# EAGLE design Drum Machine Side Lights (EAGLE 5.07)
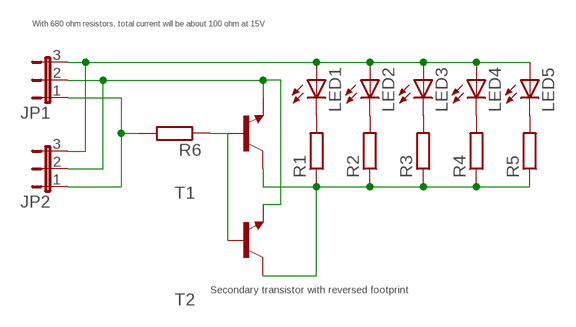
[diagram p0: schematic, sheet 1]

## Parts
JP1  JP2E  [JP2]
JP2  JP2E  [JP2]
LED1  LED3MM  [LED3MM]
LED2  LED3MM  [LED3MM]
LED3  LED3MM  [LED3MM]
LED4  LED3MM  [LED3MM]
LED5  LED3MM  [LED3MM]
R1  R-EU_0207/7  [0207/7]
R2  R-EU_0207/7  [0207/7]
R3  R-EU_0207/7  [0207/7]
R4  R-EU_0207/7  [0207/7]
R5  R-EU_0207/7  [0207/7]
R6  R-EU_0207/7  [0207/7]
T1  2N4124-NPN-TO92-CBE  [TO92-CBE]
T2  BC547A-NPN-TO92-EBC  [TO92-EBC]

## Nets
GROUND: JP1.2 JP2.2 T1.E T2.E
N$1: LED1.K(C) R1.2
N$2: LED2.K(C) R2.2
N$3: LED3.K(C) R3.2
N$4: LED4.K(C) R4.2
N$5: LED5.K(C) R5.2
N$8: R1.1 R2.1 R3.1 R4.1 R5.1 T1.C T2.C
N$13: R6.1 T1.B T2.B
POWER: JP1.3 JP2.3 LED1.A LED2.A LED3.A LED4.A LED5.A
TOGGLE: JP1.1 JP2.1 R6.2

## Notes on the sheet
- With 680 ohm resistors, total current will be about 100 ohm at 15V
- Secondary transistor with reversed footprint

## Library data of the parts
JP1 JP2 = jumper:JP2E: JUMPER
LED1-LED5 = led:LED: LED OSRAM: - CHIPLED LG R971, LG N971, LY N971, LG Q971, LY Q971, LO R971, LY R971 LH N974, LH R974 LS Q976, LO Q976, LY Q976 LO Q996 - Hyper CHIPLED LW Q18S LB Q993, LB Q99A, LB R99A - SideLED LS A670, LO A670, LY A670, LG A670, LP A670 LB A673, LV A673, LT A673, LW A673 LH A674 LY A675 LS A676, LA A676, LO A676, LY A676, LW A676 LS A679, LY A679, LG A679 - Hyper Micro SIDELED® LS Y876, LA Y876, LO Y876, LY Y876 LT Y87S - SmartLED LW L88C, LW L88S LB L89C, LB L89S, LG L890 LS L89K, LO L89K, LY L89K LS L896, LA L896, LO L896, LY L896 - TOPLED LS T670, LO T670, LY T670, LG T670, LP T670 LSG T670, LSP T670, LSY T670, LOP T670, LYG T670 LG T671, LOG T671, LSG T671 LB T673, LV T673, LT T673, LW T673 LH T674 LS T676, LA T676, LO T676, LY T676, LB T676, LH T676, LSB T676, LW T676 LB T67C, LV T67C, LT T67C, LS T67K, LO T67K, LY T67K, LW E67C LS E67B, LA E67B, LO E67B, LY E67B, LB E67C, LV E67C, LT E67C LW T67C LS T679, LY T679, LG T679 LS T770, LO T770, LY T770, LG T770, LP T770 LB T773, LV T773, LT T773, LW T773 LH T774 LS E675, LA E675, LY E675, LS T675 LS T776, LA T776, LO T776, LY T776, LB T776 LHGB T686 LT T68C, LB T68C - Hyper Mini TOPLED® LB M676 - Mini TOPLED Santana® LG M470 LS M47K, LO M47K, LY M47K Source: http://www.osram.convergy.de LUXEON: - LUMILED® LXK2-PW12-R00, LXK2-PW12-S00, LXK2-PW14-U00, LXK2-PW14-V00 LXK2-PM12-R00, LXK2-PM12-S00, LXK2-PM14-U00 LXK2-PE12-Q00, LXK2-PE12-R00, LXK2-PE12-S00, LXK2-PE14-T00, LXK2-PE14-U00 LXK2-PB12-K00, LXK2-PB12-L00, LXK2-PB12-M00, LXK2-PB14-N00, LXK2-PB14-P00, LXK2-PB14-Q00 LXK2-PR12-L00, LXK2-PR12-M00, LXK2-PR14-Q00, LXK2-PR14-R00 LXK2-PD12-Q00, LXK2-PD12-R00, LXK2-PD12-S00 LXK2-PH12-R00, LXK2-PH12-S00 LXK2-PL12-P00, LXK2-PL12-Q00, LXK2-PL12-R00 Source: www.luxeon.com KINGBRIGHT: KA-3528ASYC Source: www.kingbright.com
R1-R6 = resistor:R-EU_: RESISTOR, European symbol
T1 T2 = transistor:*-NPN-: NPN Transistror BF959 corrected 2008.03.06

## Board
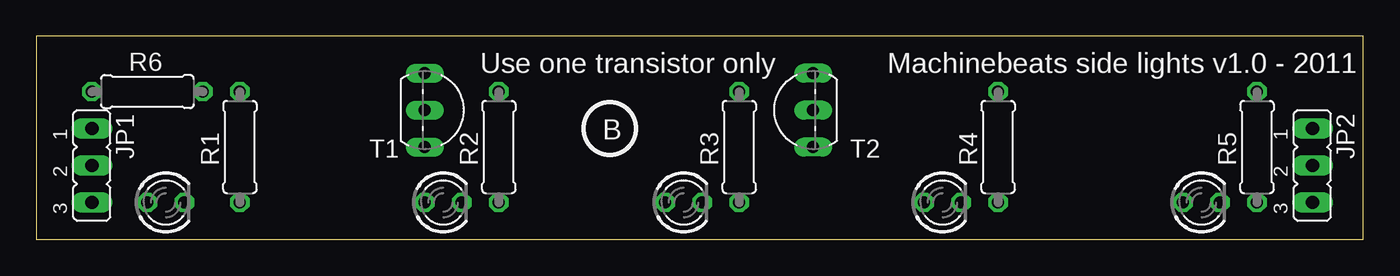
[diagram p1: board, top side]
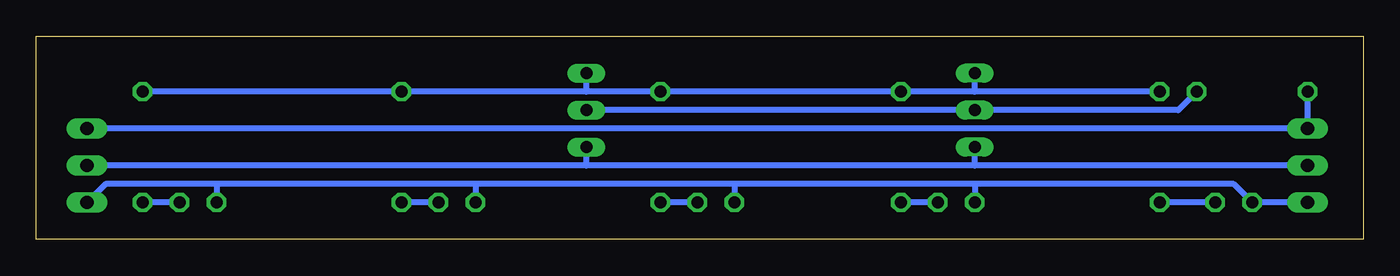
[diagram p2: board, bottom side, seen from below]

Size 91.11 x 13.96 mm. Coordinates in mm from the lower left corner, seen from the top.
Outline: 0,0 91.11,0 91.11,13.96 0,13.96 0,0
Copper layers (1*16): Top 0.035mm / dielectric 1.5mm / Bottom 0.035mm
Design rules "default": minimum track width 10mil, minimum drill 24mil, track to track 8mil, track to pad 8mil, pad to pad 8mil, via to via 8mil, smd to smd 8mil, copper to edge 40mil, drill to drill 8mil, minimum pad ring 10mil, minimum via ring 8mil, stop-mask expansion 4mil, vias tented up to drill 0mil, thermal gap 10mil

### Footprints (pad centres in the part's own frame; a part is rotated, then mirrored left to right if it is on the bottom)
JP2 = drill 0.914 long: 1 -2.54,0; 2 0,0; 3 2.54,0
LED3MM = drill 0.813 octagon: A -1.27,0; K 1.27,0
0207/7 = drill 0.813 octagon: 1 -3.81,0; 2 3.81,0
TO92-CBE = drill 0.813 long: B 0,0; C -2.54,0; E 2.54,0
TO92-EBC = drill 0.813 long: B 0,-1.27; C 2.54,-1.27; E -2.54,-1.27

### Placement (x,y rotation side)
JP1  3.81,5.08 270 top
JP2  87.63,5.08 270 top
LED1  8.89,2.54 0 top
LED2  27.94,2.54 0 top
LED3  44.45,2.54 0 top
LED4  62.23,2.54 0 top
LED5  80.01,2.54 0 top
R1  13.97,6.35 270 top
R2  31.75,6.35 270 top
R3  48.26,6.35 270 top
R4  66.04,6.35 270 top
R5  83.82,6.35 270 top
R6  7.62,10.16 180 top
T1  26.67,8.89 270 top
T2  52.07,8.89 90 top

### Tracks (layer width: path | path; a pad name or v marks a point on that pad's centre or on a via)
GROUND
  Bottom 0.406: JP1.2 26.67,5.08 | 26.67,5.08 53.34,5.08 | 53.34,5.08 JP2.2 | 26.67,5.08 T1.E | 53.34,5.08 T2.E
N$1
  Bottom 0.406: LED1.K R1.2
N$2
  Bottom 0.406: LED2.K R2.2
N$3
  Bottom 0.406: LED3.K R3.2
N$4
  Bottom 0.406: LED4.K R4.2
N$5
  Bottom 0.406: LED5.K R5.2
N$8
  Bottom 0.406: R1.1 26.67,10.16 | 26.67,10.16 R2.1 R3.1 53.34,10.16 | 53.34,10.16 R4.1 R5.1 | 26.67,10.16 T1.C | 53.34,10.16 T2.C
N$13
  Bottom 0.406: R6.1 12.7,8.89 T1.B T2.B
POWER
  Bottom 0.406: JP1.3 LED1.A 8.89,3.81 26.67,3.81 | 26.67,3.81 43.18,3.81 | 43.18,3.81 60.96,3.81 | 26.67,3.81 LED2.A | 43.18,3.81 LED3.A | 60.96,3.81 LED4.A | 60.96,3.81 78.74,3.81 | 78.74,3.81 86.36,3.81 JP2.3 | 78.74,3.81 LED5.A
TOGGLE
  Bottom 0.406: R6.2 JP1.1 JP2.1

### Text on the board
tPlace: Machinebeats side lights v1.0 - 2011 | B
tNames: Use one transistor only